# Altium schematic sheet ATTiny85.SchDoc: Digispark ATTINY85
size 199 x 139 mm; DrawnBy: Yasir Shahzad; Organization: MASTERMIND Electronics; Revision: 1.0; SheetNumber: 1; SheetTotal: 1
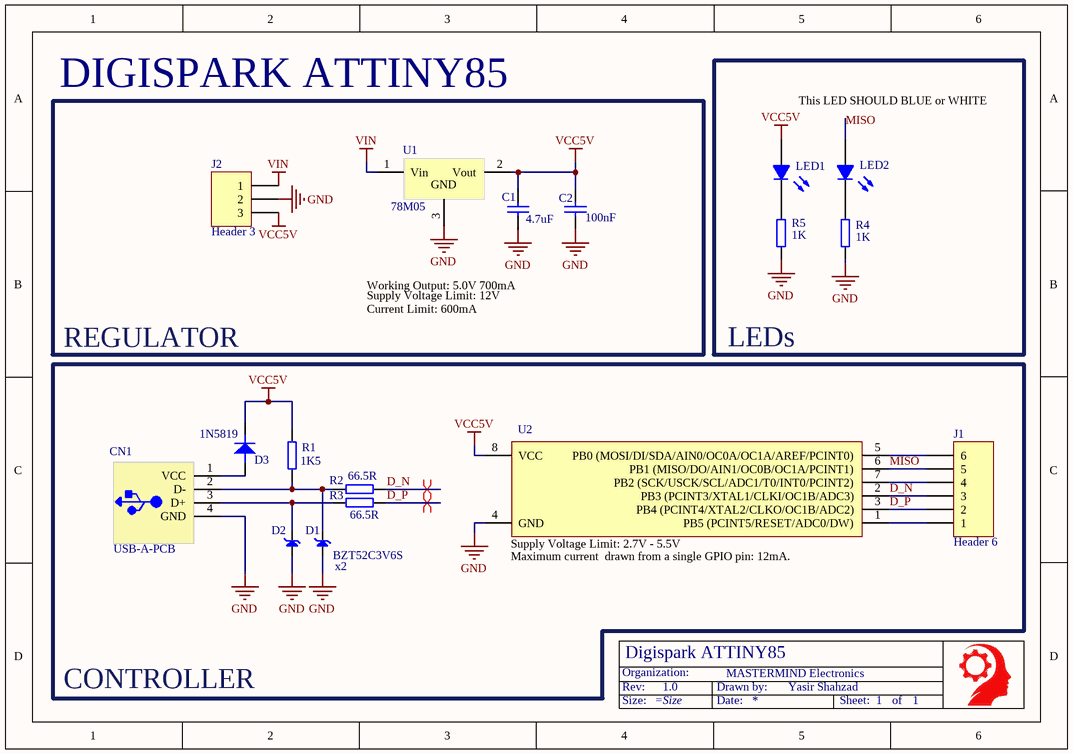
[diagram p0: ATTiny85.SchDoc]

## Parts
*  TitleBlock  (value not drawn)  (graphical)
C1  4.7uF  [C0805]  (value not drawn)
C2  100nF  [C0603]  (value not drawn)
CN1  USB ConnectorsUSBMINIB - Surface Mount Female Mini-B USB Connector 4UConnector: 06564   By microbuilder.euThru-hole RA Female Mini-B USB Connector 4UConnector: 18732   By ladyada.net  [USB-A-PCB]  (value not drawn)  (no BOM)
D1  BZT52C3V6S  [SOD-323]
D2  BZT52C3V6S  [SOD-323]  (value not drawn)
D3  1N5819  [SOD-123HE1_L3.0-W2.0-LS3.7-RD]  (value not drawn)
J1  Header 6  [HDR1X6]
J2  Header 3  [HDR1X3]
LED1  LED Red  [CHIP-LED0603]  (value not drawn)
LED2  LED Green  [CHIP-LED0603]  (value not drawn)
R1  1.5kΩ  [R0603-NO]  (value not drawn)
R2  66.5Ω  [R0603-NO]  (value not drawn)
R3  66.5Ω  [R0603-NO]  (value not drawn)
R4  1kΩ  [R0603-NO]  (value not drawn)
R5  1kΩ  [R0603-NO]  (value not drawn)
U1  78M05  [TO252]
U2  ATTINY85-20SU  [SOIC8_208MIL]  (value not drawn)

## Blocks framed on the sheet
LEDs: LED1 LED2 R4 R5
DIGISPARK ATTINY85: C1 C2 J2 U1

## Nets
GND: C1.2 C2.2 CN1.4(GND) D1.A D2.A J2.2 R4.2 R5.2 U1.3(GND) U2.4(GND)
VCC5V: C1.1 C2.1 D3.1(C) J2.3 LED1.A R1.2 U1.2(Vout) U2.8(VCC)
VIN: J2.1 U1.1(Vin)
D_N: J1.3 R2.2 U2.2(PB3_(PCINT3/XTAL1/CLKI/OC1B/ADC3))
D_P: J1.2 R3.1 U2.3(PB4_(PCINT4/XTAL2/CLKO/OC1B/ADC2))
MISO: J1.5 LED2.A U2.6(PB1_(MISO/DO/AIN1/OC0B/OC1A/PCINT1))
NetCN1_1: CN1.1(VCC) D3.2(A)
NetCN1_2: CN1.2(D-) D1.K(C) R1.1 R2.1
NetCN1_3: CN1.3(D+) D2.K(C) R3.2
NetJ1_1: J1.1 U2.1(PB5_(PCINT5/RESET/ADC0/DW))
NetJ1_4: J1.4 U2.7(PB2_(SCK/USCK/SCL/ADC1/T0/INT0/PCINT2))
NetJ1_6: J1.6 U2.5(PB0_(MOSI/DI/SDA/AIN0/OC0A/OC1A/AREF/PCINT0))
NetLED1_C: LED1.C(K) R5.1
NetLED2_C: LED2.C(K) R4.1

## Layout directives
differential pair: D_N, D_P

## Notes on the sheet
- This LED SHOULD BLUE or WHITE
- (near C1) 4.7uF
- (near C2) 100nF
- (near R5) 1K
- Working Output: 5.0V 700mA
- Supply Voltage Limit: 12V
- (near R4) 1K
- REGULATOR
- Current Limit: 600mA
- (near D3) 1N5819
- (near R1) 1K5
- (near R2) 66.5R
- (near D1) x2
- (near R3) 66.5R
- (near U2) Maximum current  drawn from a single GPIO pin: 12mA.
- (near U2) Supply Voltage Limit: 2.7V - 5.5V
- CONTROLLER
- (in symbol TitleBlock) Organization:; Rev:; Drawn by:; Size:; Date:; Sheet:; of

## Library data of the parts
* = TitleBlock: Title Block for Schematic Sheets
C1 = Cap_0805: Capacitor, X5R, ±10%, 6.3V; Manufacturer: N.A.; Specification: X7R, ±10%, 16V; Value: 4.7uF
C2 = Cap_0603: Capacitor, X5R, ±10%, 6.3V; Part Number: C0603-N.C.; Manufacturer: N.A.; Artikkelnr Noca: 20069060; Datasheet: *; LatestRevisionDate: 2009-11-23; Pin Count: 2; Publisher: Nordic Semiconductor; Published: 2009-05-08; Value: 100nF; Volts: 6.3V; Supplier: *; Supplier part number: *; 2nd source Supplier: *; 2nd source part number: *; Footprint Doc: 0603; Artikkelnr Simpro: N.A.; Manufacturer Part Number: N.A.
CN1 = USB-A-MALE_PCB: NAME: USB-A-PCB
D1 D2 = DIODE-BZT52C3V6S: Independent Type 200mW 3.6V~3.8V 3.4V SOD-323 Zener Diodes ROHS; Manufacturer: YFW(佑风微); Symbol: BZT52C3V6S_C5270767; Add into BOM: yes; Reverse Leakage Current (Ir): 5uA@1V; Zener Impedance (Zzt): 90Ω; Device: BZT52C3V6S_C5270767; LCSC Part Name: BZT52C3V6S; Supplier Part: C5270767; Manufacturer Part: BZT52C3V6S; Supplier Footprint: SOD-323; JLCPCB Part Class: Extended Part; Datasheet: https://atta.szlcsc.com/upload/public/pdf/source/20221116/07630275E16F5BD1867C326257346985.pdf; Supplier: LCSC; Convert to PCB: yes; Diode Configuration: Independent Type; Zener Voltage (Nom): 3.4V; Zener Voltage (Range): 3.6V~3.8V; Power Dissipation: 200mW
D3 = DIODE-SOD123: Schottky Diode
J1 = Header 6: Header, 6-Pin; LatestRevisionDate: 17-Jul-2002; LatestRevisionNote: Re-released for DXP Platform.; Publisher: Altium Limited
J2 = Header 3: Header, 3-Pin; LatestRevisionDate: 17-Jul-2002; LatestRevisionNote: Re-released for DXP Platform.; Publisher: Altium Limited
LED1 LED2 = LEDCHIP-LED0603: SMD lamp beads
R1-R5 = Res_0603: Resistor, ±1%, 0.100W; Part Number: R0603-N.C.Ω; Manufacturer: N.A.; Note: Chip Res; Manufacturer Part Number: N.A.; Datasheet: *; Footprint Doc: 0603; LatestRevisionDate: 2009-05-08; Pin Count: 2; Publisher: Nordic Semiconductor; Published: 2009-05-08; Supplier: *; Supplier part number: *; 2nd source Supplier: *; 2nd source part number: *; Artikkelnr Noca: N.A.; Artikkelnr Simpro: N.A.
  R1: Value: 1.5kΩ
  R2 R3: Value: 66.5Ω
  R4 R5: Value: 1kΩ
U1 = REG-7805_TO252: 5V Linear Regulator
U2 = ATTINY85-20SU: 8KB 2.7V~5.5V AVR 512Byte 20MHz FLASH 6 SOIC-8-208mil Microcontrollers (MCU/MPU/SOC) ROHS; Manufacturer: MICROCHIP(美国微芯); Add into BOM: yes; GPIO Ports Number: 6; ADC (Bit): 10bit; Peripheral/Function: PWM; Watchdog: 有; Symbol: ATTINY85-20SU; Device: ATTINY85-20SU; LCSC Part Name: ATTINY85-20SU; Supplier Part: C89852; Manufacturer Part: ATTINY85-20SU; Supplier Footprint: SOIC-8-208mil; JLCPCB Part Class: Extended Part; Datasheet: https://atta.szlcsc.com/upload/public/pdf/source/20201117/C89852_765368ABD68244126CE6B6218510DF2D.pdf; Supplier: LCSC; Convert to PCB: yes; CPU Core: AVR; Program Storage Size: 8KB; RAM Size: 512Byte; Operating Voltage Range: 2.7V~5.5V; CPU Maximum Speed: 20MHz; Program Memory Type: FLASH; EEPROM: 512Byte; Operating Temperature Range: -40℃~+85℃; DAC (Bit): -; PWM (Bit): -; Universal Serial Bus: -; Internal Comparator: -; communication protocol: -; Real-Time Clock: -; Infrared Data Association: -; Low-Voltage Detect: 有; CCP Capture/Compare: -; Secure Digital Input and Output: -; Direct Memory Access: -; Internal Oscillator: 有